# Altium schematic sheet TailBoard.SchDoc
size A
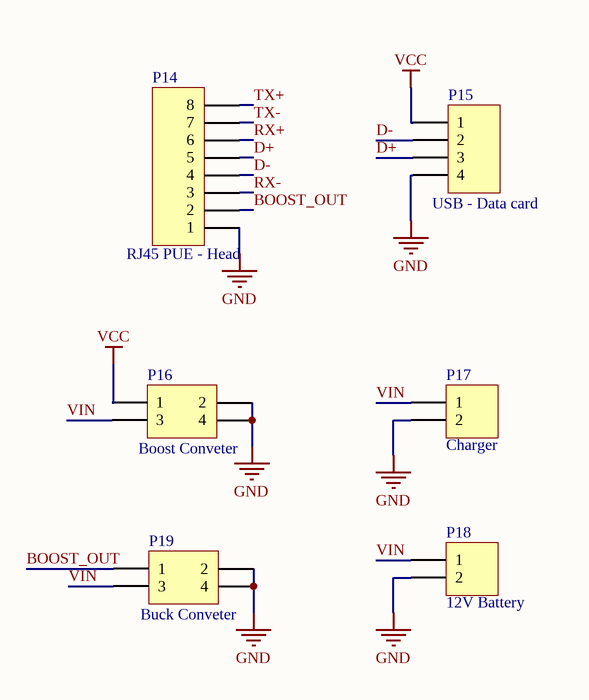
[diagram p0: TailBoard.SchDoc]

## Parts
P14  RJ45 PUE - Head  [RJ45]
P15  USB - Data card  [USB_Female]
P16  Boost Conveter  [HDR2X2]
P17  Charger  [HDR1X2]
P18  12V Battery  [HDR1X2]
P19  Buck Conveter  [HDR2X2]

## Nets
GND: P14.1 P15.4 P16.2 P16.4 P17.2 P18.2 P19.2 P19.4
VCC: P15.1 P16.1
BOOST_OUT: P14.2 P19.1
D+: P14.5 P15.3
D-: P14.4 P15.2
RX+: P14.6
RX-: P14.3
TX+: P14.8
TX-: P14.7
VIN: P16.3 P17.1 P18.1 P19.3

## Library data of the parts
P14 = Header 8: Header, 8-Pin; LatestRevisionDate: 17-Jul-2002; LatestRevisionNote: Re-released for DXP Platform.; Publisher: Altium Limited
P15 = Header 4: Header, 4-Pin; LatestRevisionDate: 17-Jul-2002; LatestRevisionNote: Re-released for DXP Platform.; Publisher: Altium Limited
P16 P19 = Header 2X2: Header, 2-Pin, Dual row; LatestRevisionDate: 17-Jul-2002; LatestRevisionNote: Re-released for DXP Platform.; Publisher: Altium Limited
P17 P18 = Header 2: Header, 2-Pin; LatestRevisionDate: 17-Jul-2002; LatestRevisionNote: Re-released for DXP Platform.; Publisher: Altium Limited